# EAGLE design mainPCB (EAGLE 9.2.2)
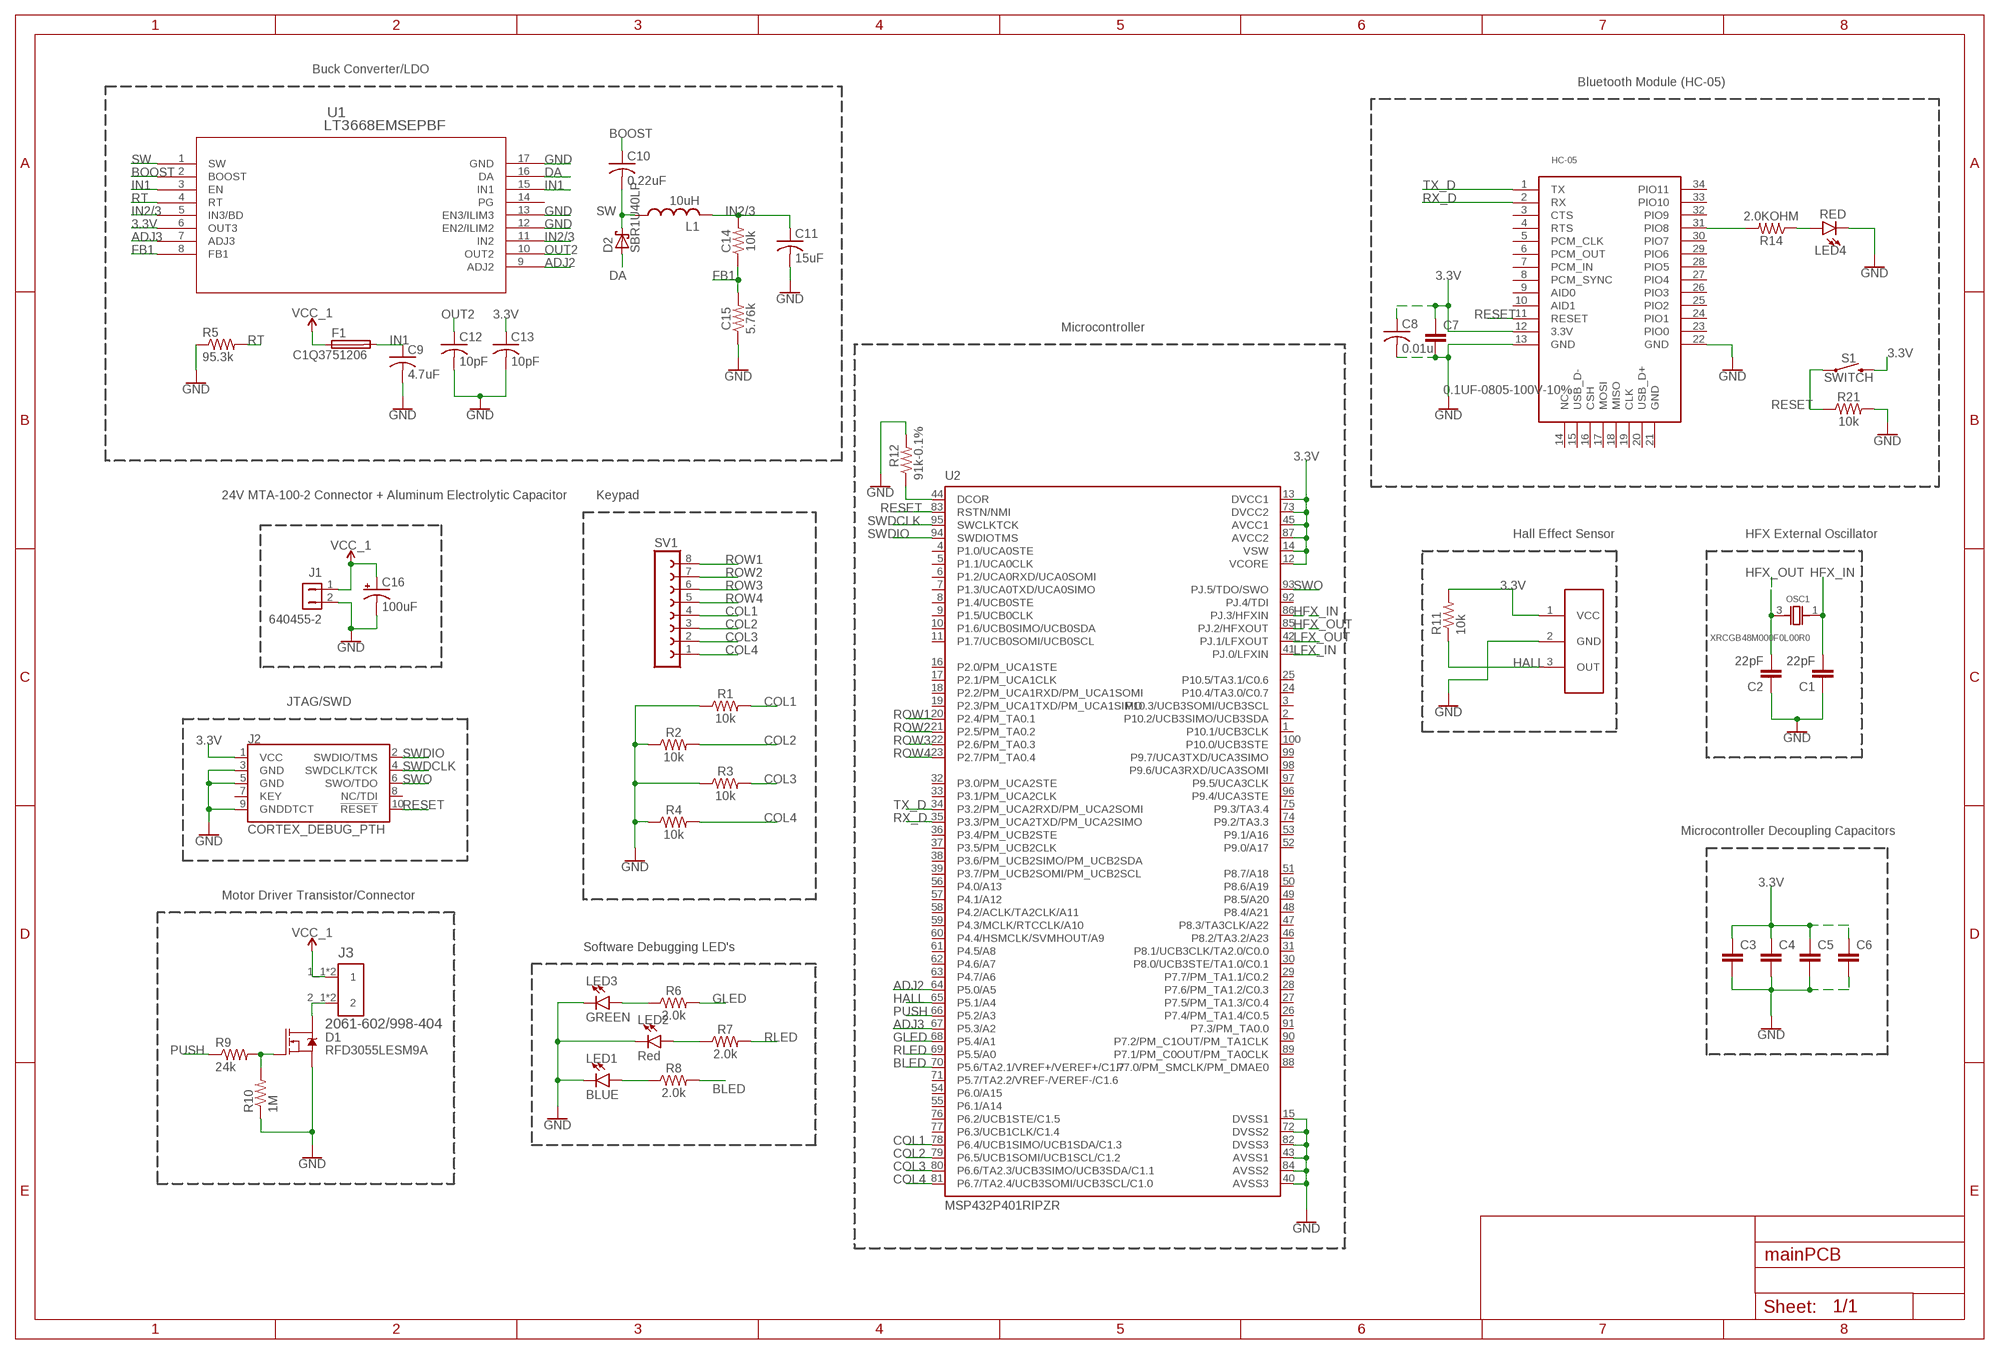
[diagram p0: schematic, sheet 1]

## Parts
C1  22pF  22PF-0603-50V-5%  [0603]
C2  22pF  22PF-0603-50V-5%  [0603]
C3  0.1UF-0805-100V-10%  [0805]
C4  0.1UF-0805-100V-10%  [0805]
C5  0.1UF-0805-100V-10%  [0805]
C6  0.1UF-0805-100V-10%  [0805]
C7  0.1UF-0805-100V-10%  [0805]
C8  0.01u  C-USC0805  [C0805]
C9  4.7uF  C-USC0805  [C0805]
C10  0.22uF  C-USC0805  [C0805]
C11  15uF  C-USC0805  [C0805]
C12  10pF  C-USC0805  [C0805]
C13  10pF  C-USC0805  [C0805]
C14  10k  ERJ-PB6  [R0805]
C15  5.76k  ERJ-PB6  [R0805]
C16  100uF  EEE-1HA101UP  [PANASONIC_D]
D1  RFD3055LESM9A  [DPAK229P990X239-4N]
D2  SBR1U40LP  [3-XDFN]
F1  C1Q3751206  [C1206]
H1  HES  AH1807-P-B  [SIP3-UA]
HC-05  HC-05  HC-05HC-05  [XCVR_HC-05]
J1  640455-2  [2-PIN_CONNECTOR]
J2  CORTEX_DEBUG_PTH  [2X5-PTH-1.27MM]
J3  2061-602/998-404  [WAGO_2061-602/998-404]
L1  10uH  CBC3225T150KR1210  [L3225M]
LED1  BLUE  LED-BLUE0603  [LED-0603]
LED2  Red  LED-RED0603-SMART  [LED-0603]
LED3  GREEN  LED-GREEN0603  [LED-0603]
LED4  RED  LED-RED0603  [LED-0603]
OSC1  XRCGB48M000F0L00R0  [XTAL_XRCGB24M000F0L00R0]
R1  10k  10KOHM-0805-1/4W-1%  [0805]
R2  10k  10KOHM-0805-1/4W-1%  [0805]
R3  10k  10KOHM-0805-1/4W-1%  [0805]
R4  10k  10KOHM-0805-1/4W-1%  [0805]
R5  95.3k  R-US_R0805  [R0805]
R6  2.0k  2.0KOHM-0603-1/10W-5%  [0603]
R7  2.0k  2.0KOHM-0603-1/10W-5%  [0603]
R8  2.0k  2.0KOHM-0603-1/10W-5%  [0603]
R9  24k  R-US_R0805  [R0805]
R10  1M  R-US_R0805  [R0805]
R11  10k  R-US_R0805  [R0805]
R12  91k-0.1%  R-US_R0805  [R0805]
R14  2.0KOHM  [0805]
R21  10k  10KOHM-0805-1/4W-1%  [0805]
S1  SWITCH  MOMENTARY-SWITCH-SPST-SMD-5.2-REDUNDANT  [TACTILE_SWITCH_SMD_5.2MM]
SV1  FE08-1  [FE08]
U1  LT3668EMSEPBF  [MSOP-16_MSE]
U2  MSP432P401RIPZR  [QFP50P1600X1600X160-100N]

## Nets
3.3V: C3.1 C4.1 C5.1 C6.1 C7.1 C8.1 C13.1 H1.1(VCC) HC-05.12(3.3V) J2.1(VCC) R11.2 S1.3 S1.4 U1.6(OUT3) U2.12(VCORE) U2.13(DVCC1) U2.14(VSW) U2.45(AVCC1) U2.73(DVCC2) U2.87(AVCC2)
ADJ2: U1.9(ADJ2) U2.64(P5.0/A5)
ADJ3: U1.7(ADJ3) U2.67(P5.3/A2)
BLED: R8.2 U2.70(P5.6/TA2.1/VREF+/VEREF+/C1.7)
BOOST: C10.1 U1.2(BOOST)
COL1: R1.2 SV1.4 U2.78(P6.4/UCB1SIMO/UCB1SDA/C1.3)
COL2: R2.2 SV1.3 U2.79(P6.5/UCB1SOMI/UCB1SCL/C1.2)
COL3: R3.2 SV1.2 U2.80(P6.6/TA2.3/UCB3SIMO/UCB3SDA/C1.1)
COL4: R4.2 SV1.1 U2.81(P6.7/TA2.4/UCB3SOMI/UCB3SCL/C1.0)
DA: D2.1(A) U1.16(DA)
FB1: C14.1 C15.2 U1.8(FB1)
GLED: R6.2 U2.68(P5.4/A1)
GND: C1.1 C2.1 C3.2 C4.2 C5.2 C6.2 C7.2 C8.2 C9.2 C11.2 C12.2 C13.2 C15.1 C16.- D1.3(S) H1.2(GND) HC-05.13(GND) HC-05.22(GND) J1.2 J2.3(GND) J2.5(GND) J2.9(GNDDTCT) LED1.C LED2.C LED3.C LED4.C R1.1 R2.1 R3.1 R4.1 R5.1 R10.1 R12.2 R21.2 U1.12(EN2/ILIM2) U1.13(EN3/ILIM3) U1.17(GND) U2.15(DVSS1) U2.40(AVSS3) U2.43(AVSS1) U2.72(DVSS2) U2.82(DVSS3) U2.84(AVSS2)
HALL: H1.3(OUT) R11.1 U2.65(P5.1/A4)
HFX_IN: C1.2 OSC1.1 U2.86(PJ.3/HFXIN)
HFX_OUT: C2.2 OSC1.3 U2.85(PJ.2/HFXOUT)
IN1: C9.1 F1.2 U1.3(EN) U1.15(IN1)
IN2/3: C11.1 C14.2 L1.2 U1.5(IN3/BD) U1.11(IN2)
LFX_IN: U2.41(PJ.0/LFXIN)
LFX_OUT: U2.42(PJ.1/LFXOUT)
N$1: D1.1(G) R9.2 R10.2
N$2: D1.4(D) J3.2_1 J3.2_2
N$3: LED4.A R14.1
N$4: LED3.A R6.1
N$5: LED2.A R7.1
N$8: LED1.A R8.1
N$12: R12.1 U2.44(DCOR)
N$19: HC-05.31(PIO8) R14.2
OUT2: C12.1 U1.10(OUT2)
PUSH: R9.1 U2.66(P5.2/A3)
RESET: HC-05.11(RESET) J2.10(!RESET) R21.1 S1.1 S1.2 U2.83(RSTN/NMI)
RLED: R7.2 U2.69(P5.5/A0)
ROW1: SV1.8 U2.20(P2.4/PM_TA0.1)
ROW2: SV1.7 U2.21(P2.5/PM_TA0.2)
ROW3: SV1.6 U2.22(P2.6/PM_TA0.3)
ROW4: SV1.5 U2.23(P2.7/PM_TA0.4)
RT: R5.2 U1.4(RT)
RX_D: HC-05.2(RX) U2.35(P3.3/PM_UCA2TXD/PM_UCA2SIMO)
SW: C10.2 D2.2(C) D2.3(C) L1.1 U1.1(SW)
SWDCLK: J2.4(SWDCLK/TCK) U2.95(SWCLKTCK)
SWDIO: J2.2(SWDIO/TMS) U2.94(SWDIOTMS)
SWO: J2.6(SWO/TDO) U2.93(PJ.5/TDO/SWO)
TX_D: HC-05.1(TX) U2.34(P3.2/PM_UCA2RXD/PM_UCA2SOMI)
VCC_1: C16.+ F1.1 J1.1 J3.1_1 J3.1_2
Unconnected: HC-05.3(CTS) HC-05.4(RTS) HC-05.5(PCM_CLK) HC-05.6(PCM_OUT) HC-05.7(PCM_IN) HC-05.8(PCM_SYNC) HC-05.9(AID0) HC-05.10(AID1) HC-05.14(NC) HC-05.15(USB_D-) HC-05.16(CSH) HC-05.17(MOSI) HC-05.18(MISO) HC-05.19(CLK) HC-05.20(USB_D+) HC-05.21(GND) HC-05.23(PIO0) HC-05.24(PIO1) HC-05.25(PIO2) HC-05.26(PIO3) HC-05.27(PIO4) HC-05.28(PIO5) HC-05.29(PIO6) HC-05.30(PIO7) HC-05.32(PIO9) HC-05.33(PIO10) HC-05.34(PIO11) J2.7(KEY) J2.8(NC/TDI) U1.14(PG) U2.1(P10.1/UCB3CLK) U2.2(P10.2/UCB3SIMO/UCB3SDA) U2.3(P10.3/UCB3SOMI/UCB3SCL) U2.4(P1.0/UCA0STE) U2.5(P1.1/UCA0CLK) U2.6(P1.2/UCA0RXD/UCA0SOMI) U2.7(P1.3/UCA0TXD/UCA0SIMO) U2.8(P1.4/UCB0STE) U2.9(P1.5/UCB0CLK) U2.10(P1.6/UCB0SIMO/UCB0SDA) U2.11(P1.7/UCB0SOMI/UCB0SCL) U2.16(P2.0/PM_UCA1STE) U2.17(P2.1/PM_UCA1CLK) U2.18(P2.2/PM_UCA1RXD/PM_UCA1SOMI) U2.19(P2.3/PM_UCA1TXD/PM_UCA1SIMO) U2.24(P10.4/TA3.0/C0.7) U2.25(P10.5/TA3.1/C0.6) U2.26(P7.4/PM_TA1.4/C0.5) U2.27(P7.5/PM_TA1.3/C0.4) U2.28(P7.6/PM_TA1.2/C0.3) U2.29(P7.7/PM_TA1.1/C0.2) U2.30(P8.0/UCB3STE/TA1.0/C0.1) U2.31(P8.1/UCB3CLK/TA2.0/C0.0) U2.32(P3.0/PM_UCA2STE) U2.33(P3.1/PM_UCA2CLK) U2.36(P3.4/PM_UCB2STE) U2.37(P3.5/PM_UCB2CLK) U2.38(P3.6/PM_UCB2SIMO/PM_UCB2SDA) U2.39(P3.7/PM_UCB2SOMI/PM_UCB2SCL) U2.46(P8.2/TA3.2/A23) U2.47(P8.3/TA3CLK/A22) U2.48(P8.4/A21) U2.49(P8.5/A20) U2.50(P8.6/A19) U2.51(P8.7/A18) U2.52(P9.0/A17) U2.53(P9.1/A16) U2.54(P6.0/A15) U2.55(P6.1/A14) U2.56(P4.0/A13) U2.57(P4.1/A12) U2.58(P4.2/ACLK/TA2CLK/A11) U2.59(P4.3/MCLK/RTCCLK/A10) U2.60(P4.4/HSMCLK/SVMHOUT/A9) U2.61(P4.5/A8) U2.62(P4.6/A7) U2.63(P4.7/A6) U2.71(P5.7/TA2.2/VREF-/VEREF-/C1.6) U2.74(P9.2/TA3.3) U2.75(P9.3/TA3.4) U2.76(P6.2/UCB1STE/C1.5) U2.77(P6.3/UCB1CLK/C1.4) U2.88(P7.0/PM_SMCLK/PM_DMAE0) U2.89(P7.1/PM_C0OUT/PM_TA0CLK) U2.90(P7.2/PM_C1OUT/PM_TA1CLK) U2.91(P7.3/PM_TA0.0) U2.92(PJ.4/TDI) U2.96(P9.4/UCA3STE) U2.97(P9.5/UCA3CLK) U2.98(P9.6/UCA3RXD/UCA3SOMI) U2.99(P9.7/UCA3TXD/UCA3SIMO) U2.100(P10.0/UCB3STE)

## Notes on the sheet
- Buck Converter/LDO
- Bluetooth Module (HC-05)
- Microcontroller
- 24V MTA-100-2 Connector + Aluminum Electrolytic Capacitor | Keypad
- Hall Effect Sensor | HFX External Oscillator
- JTAG/SWD
- Microcontroller Decoupling Capacitors
- Motor Driver Transistor/Connector
- Software Debugging LED's

## Library data of the parts
C1 C2 = SparkFun-Capacitors:22PF: 22pF ceramic capacitors A capacitor is a passive two-terminal electrical component used to store electrical energy temporarily in an electric field.; PROD_ID: CAP-07876
C3-C7 = SENIOR_DESIGN_COMPONENTS:0.1UF: 0.1µF ceramic capacitors A capacitor is a passive two-terminal electrical component used to store electrical energy temporarily in an electric field.
C8-C13 = SENIOR_DESIGN_COMPONENTS:C-US: CAPACITOR, American symbol; SPICEPREFIX: C
C14 C15 = SENIOR_DESIGN_COMPONENTS:ERJ-PB6
C16 = SENIOR_DESIGN_COMPONENTS:EEE-1HA101UP
D1 = SENIOR_DESIGN_COMPONENTS:RFD3055LESM9A
D2 = SENIOR_DESIGN_COMPONENTS:SBR1U40LP
F1 = SENIOR_DESIGN_COMPONENTS:C1Q375
H1 = SENIOR_DESIGN_COMPONENTS:AH1807-P-B
HC-05 = SENIOR_DESIGN_COMPONENTS:HC-05
J1 = SENIOR_DESIGN_COMPONENTS:640455-2: 2 Pin Rectangular Connector; AVAILABILITY: Unavailable; COMMENT: 640455-2; DESCRIPTION: MTA-100 2 Position 2.54 mm Single Row Right Angle Wire to Board Header; EU_ROHS_COMPLIANCE: Compliant; MF: TE Connectivity; MP: 640455-2; PACKAGE: None; PRICE: None; TE_PURCHASE_URL: https://www.te.com/usa-en/product-640455-2.html?te_bu=Cor&te_type=disp&te_campaign=seda_glo_cor-seda-global-disp-prtnr-fy19-seda-model-bom-cta_sma-317_1&elqCampaignId=32493
J2 = SparkFun-Connectors:CORTEX_DEBUG: Cortex Debug Connector - 10 pin Supports JTAG debug, Serial Wire debug, and Serial Wire Viewer. PTH and SMD connector options available. General Connector Information <http://infocenter.arm.com/help/topic/com.arm.doc.faqs/attached/13634/cortex_debug_connectors.pdf> Products: PTH Connector <http://www.digikey.com/product-detail/en/cnc-tech/3220-10-0100-00/1175-1627-ND/3883661> -via Digi-Key SparkFun PSoc <https://www.sparkfun.com/products/13229> SparkFun T <https://www.sparkfun.com/products/13810>
J3 = SENIOR_DESIGN_COMPONENTS:2061-602/998-404: 2061 Series 2 Position 20-16 AWG 6 mm Spacing Surface Mount Terminal Block; AVAILABILITY: Unavailable; DESCRIPTION: 2061 Series 2 Position 20-16 AWG 6 mm Spacing Surface Mount Terminal Block; MF: WAGO; MP: 2061-602/998-404; PACKAGE: None; PRICE: None
L1 = SENIOR_DESIGN_COMPONENTS:CBC3225T150KR
LED1 = SENIOR_DESIGN_COMPONENTS:LED-BLUE: Blue SMD LED Used in manufacturing of various products at SparkFun Packages: 0603 - SMD 0603 package [Product Link] <http://www.digikey.com/product-detail/en/SMLE12BC7TT86/511-1589-2-ND/1641808> 1206 - SMD1206 package [Product Link] <http://www.digikey.com/product-detail/en/lite-on-inc/LTST-C150TBKT/160-1643-1-ND/573584> SparkFun Products: ESP8266 Thing-Dev Board <https://www.sparkfun.com/products/13711> RedBoard <https://www.sparkfun.com/products/12757>; PROD_ID: DIO-08575
LED2 = SENIOR_DESIGN_COMPONENTS:LED-RED: Red SMD LED Used in manufacturing of most products at SparkFun Packages: 0603 - SMD 0603 package [Product Link] <http://docs.avagotech.com/docs/AV02-0551EN> 0603 SMART - SMD 0603 SMART package ( more efficient and expensive)[Product Link] <http://www.osram-os.com/Graphics/XPic2/00077099_0.pdf> 1206 - SMD1206 package [Product Link] <https://www.sparkfun.com/datasheets/DevTools/LilyPad/Q150OVS4.pdff> SparkFun Products: Pro Mini 328 -5V <https://www.sparkfun.com/products/821> RedBoard <https://www.sparkfun.com/products/12757> IOIO-OTG <https://www.sparkfun.com/products/13613>; PROD_ID: DIO-11154
LED3 = SENIOR_DESIGN_COMPONENTS:LED-GREEN: Green SMD LED Used in manufacturing of various products at SparkFun Packages: 0603 - SMD 0603 package [Product Link] <http://www.futureelectronics.com/en/technologies/semiconductors/optoelectronics/leds/Pages/9894312-LTST-C190GKT.aspx?CrossPart=HSMG-C190&IM=0> LilyPad 1206 - SMD1206 LilyPad package [Product Link] <http://www.futureelectronics.com/en/Technologies/Product.aspx?ProductID=IN150NGHARVATEKCORPORATION2049943&IM=0> 1206 - SMD1206 package [Product Link] <http://www.futureelectronics.com/en/technologies/semiconductors/optoelectronics/leds/Pages/8315665-LTST-C150KGKT.aspx?IM=0> 1206 Bottom Mount -SMD 1206 Bottom Mount [Product Link] <http://www.digikey.com/product-detail/en/lite-on-inc/LTST-C230KGKT/160-1456-1-ND/386854> SparkFun Products: Pro Mini 328 -5V <https://www.sparkfun.com/products/821> RedBoard <https://www.sparkfun.com/products/12757> MP3 Trigger <https://www.sparkfun.com/products/13720> Makey Makey <https://www.sparkfun.com/products/11076>; PROD_ID: DIO-00821
LED4 = SENIOR_DESIGN_COMPONENTS:LED-RED: Red SMD LED Used in manufacturing of most products at SparkFun Packages: 0603 - SMD 0603 package [Product Link] <http://docs.avagotech.com/docs/AV02-0551EN> 0603 SMART - SMD 0603 SMART package ( more efficient and expensive)[Product Link] <http://www.osram-os.com/Graphics/XPic2/00077099_0.pdf> 1206 - SMD1206 package [Product Link] <https://www.sparkfun.com/datasheets/DevTools/LilyPad/Q150OVS4.pdff> SparkFun Products: Pro Mini 328 -5V <https://www.sparkfun.com/products/821> RedBoard <https://www.sparkfun.com/products/12757> IOIO-OTG <https://www.sparkfun.com/products/13613>; PROD_ID: DIO-00819
OSC1 = SENIOR_DESIGN_COMPONENTS:XRCGB48M000F0L00R0
R1-R4 R21 = SENIOR_DESIGN_COMPONENTS:10KOHM: 10kΩ resistor A resistor is a passive two-terminal electrical component that implements electrical resistance as a circuit element. Resistors act to reduce current flow, and, at the same time, act to lower voltage levels within circuits. - Wikipedia
R5 R9-R12 = SENIOR_DESIGN_COMPONENTS:R-US_: RESISTOR, American symbol; SPICEPREFIX: R
R6-R8 = SENIOR_DESIGN_COMPONENTS:2.0KOHM: 2kΩ resistor A resistor is a passive two-terminal electrical component that implements electrical resistance as a circuit element. Resistors act to reduce current flow, and, at the same time, act to lower voltage levels within circuits. - Wikipedia; PROD_ID: RES-08296
R14 = SENIOR_DESIGN_COMPONENTS:2.0KOHM: 2kΩ resistor A resistor is a passive two-terminal electrical component that implements electrical resistance as a circuit element. Resistors act to reduce current flow, and, at the same time, act to lower voltage levels within circuits. - Wikipedia
S1 = SENIOR_DESIGN_COMPONENTS:MOMENTARY-SWITCH-SPST: Momentary Switch (Pushbutton) - SPST Normally-open (NO) SPST momentary switches (buttons, pushbuttons). Variants PTH-12MM - 12mm square, through-hole Momentary Pushbutton Switch - 12mm Square <https://www.sparkfun.com/products/9190> (COM-09190) PTH-6.0MM, PTH-6.0MM-KIT - 6.0mm square, through-hole Mini Pushbutton Switch <https://www.sparkfun.com/products/97> (COM-00097) KIT package intended for soldering kit's - only one side of pads' copper is exposed. PTH-RIGHT-ANGLE-KIT - Right-angle, through-hole Right Angle Tactile Button <https://www.sparkfun.com/products/10791> - Used on SparkFun BigTime Watch Kit <https://www.sparkfun.com/products/11734> SMD-12MM - 12mm square, surface-mount Tactile Button - SMD (12mm) <https://www.sparkfun.com/products/12993> (COM-12993) Used on SparkFun PicoBoard <https://www.sparkfun.com/products/11888> SMD-4.5MM - 4.5mm Square Trackball Switch Used on SparkFun Blackberry Trackballer Breakout <https://www.sparkfun.com/products/13169> SMD-4.6MMX2.8MM - 4.60mm x 2.80mm, surface mount Used on SparkFun SAMD21 Mini Breakout <https://www.sparkfun.com/products/13664> SMD-5.2MM, SMD-5.2-REDUNDANT - 5.2mm square, surface-mount Mini Pushbutton Switch - SMD <https://www.sparkfun.com/products/8720> (COM-08720) Used on Arduino Pro Mini <https://www.sparkfun.com/products/11114> REDUNDANT package connects both switch circuits together SMD-6.0X3.5MM - 6.0 x 3.5mm, surface mount Momentary Reset Switch SMD <https://www.sparkfun.com/products/8229> (COM-08229) SMD-6.2MM-TALL - 6.2mm square, surface mount Tactile Button - SMD (6mm) <https://www.sparkfun.com/products/12992> Used on SparkFun Digital Sandbox <https://www.sparkfun.com/products/12651> SMD-RIGHT-ANGLE - Right-angle, surface mount Used on SparkFun Block for Intel® Edison - Arduino <https://www.sparkfun.com/products/13036>; PROD_ID: SWCH-08247; SF_SKU: COM-08720
SV1 = SENIOR_DESIGN_COMPONENTS:FE08-1: FEMALE HEADER; OC_FARNELL: unknown; OC_NEWARK: unknown
U1 = SENIOR_DESIGN_COMPONENTS:LT3668EMSEPBF; DESCRIPTION: LT3668 - 40V 400mA Step-Down Switching Regulator with Dual Fault Protected Tracking LDOs; DIGI-KEY_PART_NUMBER: LT3668EMSE#PBF-ND; DIGI-KEY_PURCHASE_URL: https://www.digikey.com/product-detail/en/linear-technology-analog-devices/LT3668EMSE-PBF/LT3668EMSE-PBF-ND/5030729?utm_source=snapeda&utm_medium=aggregator&utm_campaign=symbol; MF: Linear Technology; MP: LT3668EMSE#PBF; PACKAGE: MSOP-16 Linear Technology
U2 = SENIOR_DESIGN_COMPONENTS:MSP432P401RIPZR: Low-Power and High Performance 32-Bit ARM Cortex M4F With 256KB Flash and 64KB RAM 100-LQFP -40 to 85; AVAILABILITY: Unavailable; DESCRIPTION: Low-Power and High Performance 32-Bit ARM Cortex M4F With 256KB Flash and 64KB RAM 100-LQFP -40 to 85; MF: Texas Instruments; MP: MSP432P401RIPZR; PACKAGE: LQFP-100 Texas Instruments; PRICE: None

## Board
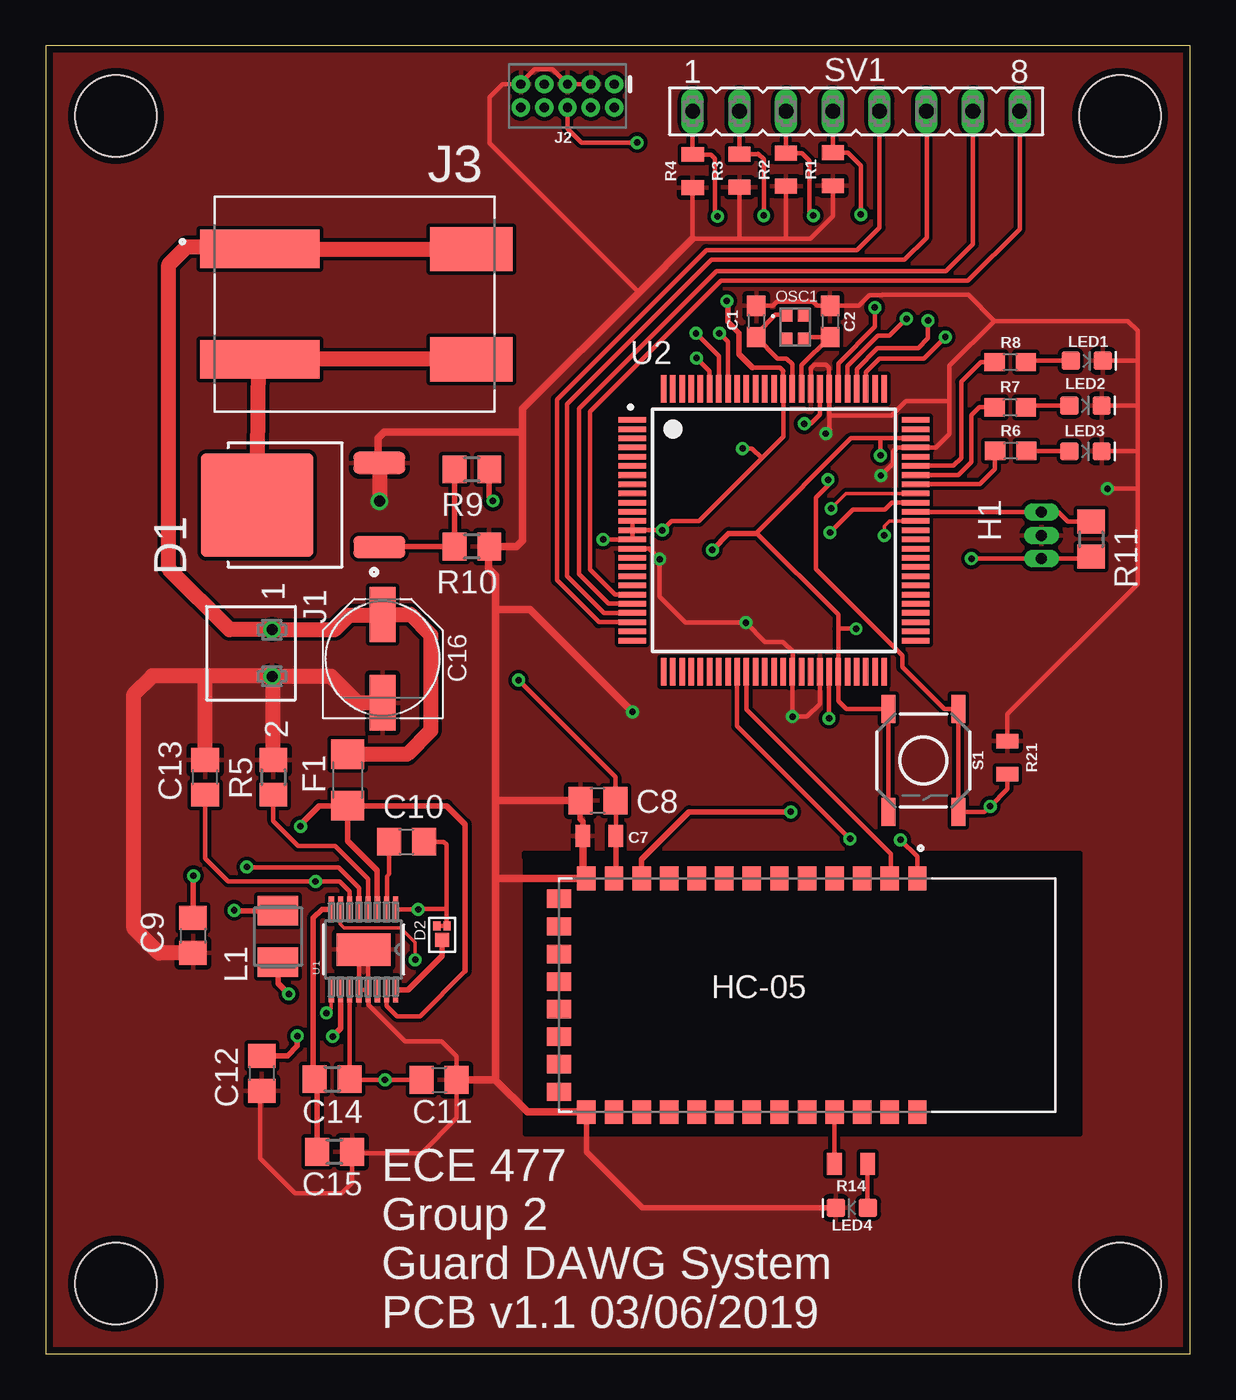
[diagram p1: board, top side]
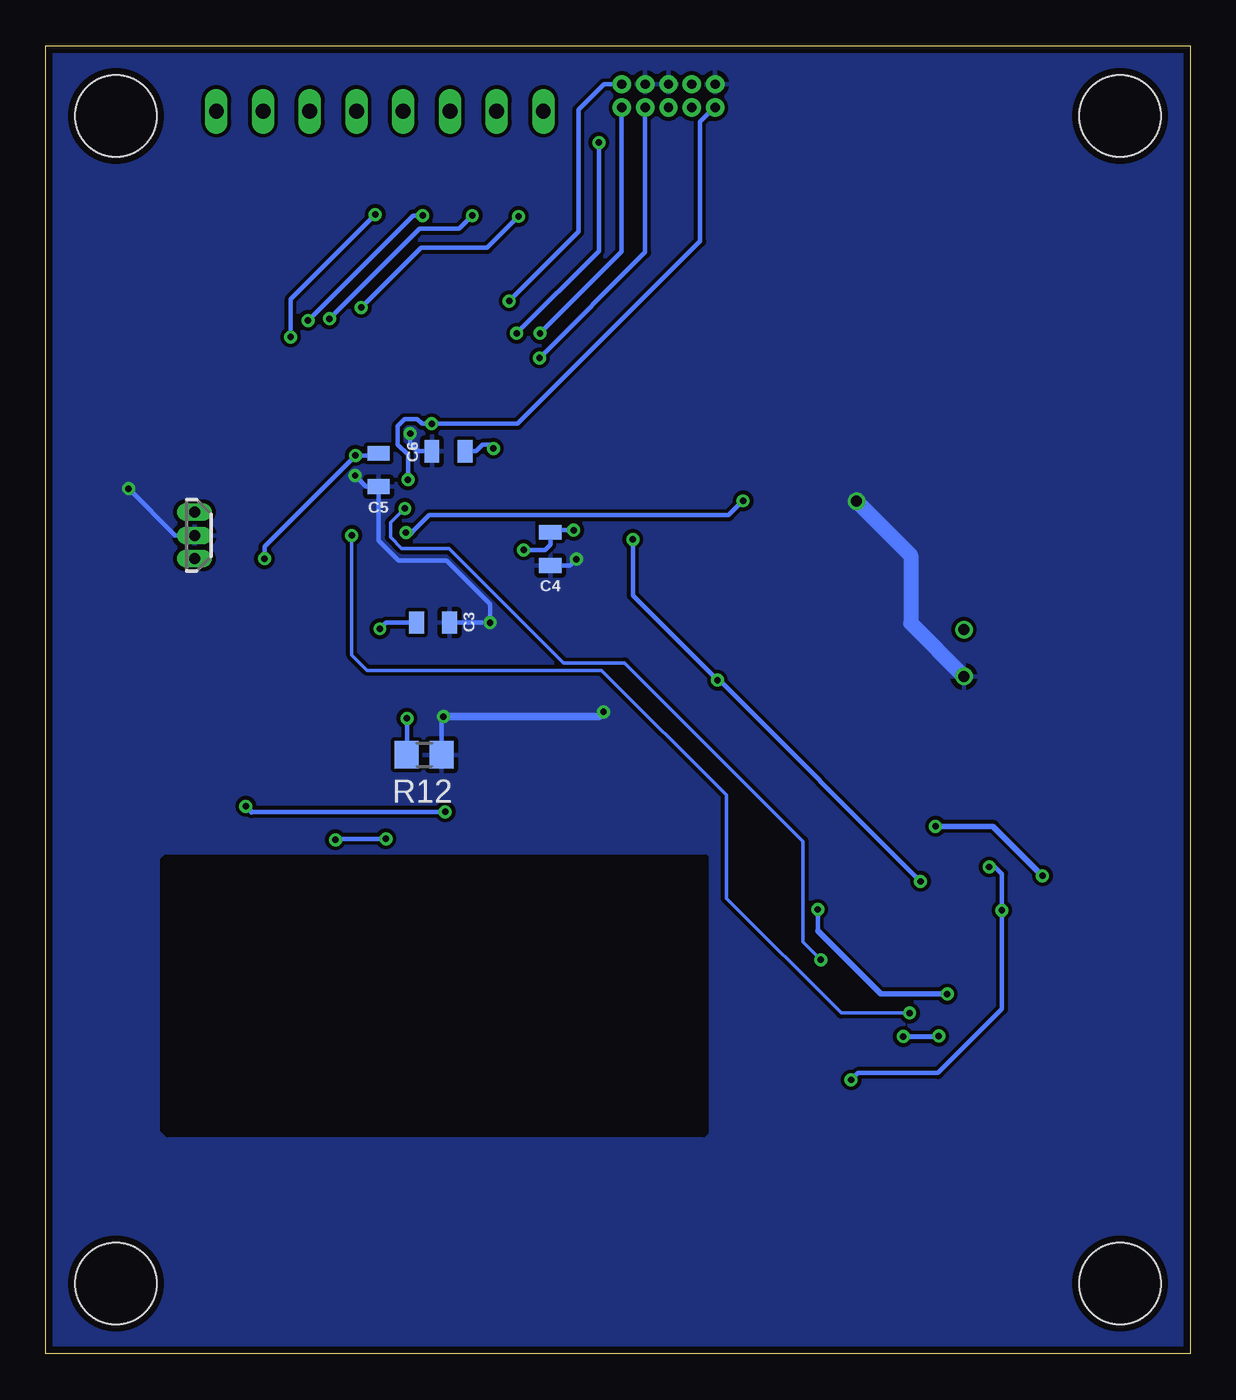
[diagram p2: board, bottom side, seen from below]

Size 62.23 x 71.12 mm. Coordinates in mm from the lower left corner, seen from the top.
Outline: 0,0 62.23,0 62.23,71.12 0,71.12 0,0
Copper layers (1*16): Top 0.0356mm / dielectric 1.5011mm / Bottom 0.0356mm
Design rules "ECE_Senior_Design": minimum track width 8mil, minimum drill 13mil, track to track 8mil, track to pad 8mil, pad to pad 6mil, via to via 8mil, smd to smd 6mil, copper to edge 15mil, drill to drill 8mil, minimum pad ring 7mil, minimum via ring 7mil, stop-mask expansion 3mil, vias tented up to drill 0mil, thermal gap 10mil
Holes 4.45 mm at 3.81,67.31 58.42,67.31 58.42,3.81 3.81,3.81

### Footprints (pad centres in the part's own frame; a part is rotated, then mirrored left to right if it is on the bottom)
0603 = smd 1.1 x 1: 1 -0.85,0; 2 0.85,0
0805 = smd 0.8 x 1.2: 1 -0.9,0; 2 0.9,0
C0805 = smd 1.3 x 1.5: 1 -0.95,0; 2 0.95,0
R0805 = smd 1.3 x 1.5: 1 -0.95,0; 2 0.95,0
PANASONIC_D = smd 3 x 1.4: + 2.4,0; - -2.4,0
DPAK229P990X239-4N = smd 1.22 x 2.83: 1 -2.29,-4.14; 3 2.29,-4.14 | smd 5.63 x 6.1: 4 0,2.51
3-XDFN = smd 0.75 x 0.75: 1 0,0 | smd 0.48 x 0.4: 2 0.76,0.275; 3 0.76,-0.275
C1206 = smd 1.6 x 1.8: 1 -1.4,0; 2 1.4,0
SIP3-UA = drill 0.6 pad 0.7 long: 1 -1.27,0; 2 0,0; 3 1.27,0
XCVR_HC-05 = smd 1.3 x 1: 1 -6.35,6.325; 2 -6.35,4.825; 3 -6.35,3.325; 4 -6.35,1.825; 5 -6.35,0.325; 6 -6.35,-1.175; 7 -6.35,-2.675; 8 -6.35,-4.175; 9 -6.35,-5.675; 10 -6.35,-7.175; 11 -6.35,-8.675; 12 -6.35,-10.175; 13 -6.35,-11.675; 22 6.35,-11.675; 23 6.35,-10.175; 24 6.35,-8.675; 25 6.35,-7.175; 26 6.35,-5.675; 27 6.35,-4.175; 28 6.35,-2.675; 29 6.35,-1.175; 30 6.35,0.325; 31 6.35,1.825; 32 6.35,3.325; 33 6.35,4.825; 34 6.35,6.325 | smd 1 x 1.3: 14 -5.25,-13.175; 15 -3.75,-13.175; 16 -2.25,-13.175; 17 -0.75,-13.175; 18 0.75,-13.175; 19 2.25,-13.175; 20 3.75,-13.175; 21 5.25,-13.175
2-PIN_CONNECTOR = drill 0.6: 1 -1.27,0; 2 1.27,0
2X5-PTH-1.27MM = drill 0.508 pad 1: 1 -2.54,-0.635; 2 -2.54,0.635; 3 -1.27,-0.635; 4 -1.27,0.635; 5 0,-0.635; 6 0,0.635; 7 1.27,-0.635; 8 1.27,0.635; 9 2.54,-0.635; 10 2.54,0.635
WAGO_2061-602/998-404 = smd 6.5 x 2.1: 1_1 -5.15,3; 2_1 -5.15,-3 | smd 4.5 x 2.4: 1_2 6.35,3; 2_2 6.35,-3
L3225M = smd 1.6 x 2.2: 1 -1.4,0; 2 1.4,0
LED-0603 = smd 1 x 1: A -0.877,0; C 0.877,0
XTAL_XRCGB24M000F0L00R0 = smd 0.7 x 0.75: 1 -0.5,0.675; 2 -0.5,-0.675; 3 0.5,-0.675; 4 0.5,0.675
TACTILE_SWITCH_SMD_5.2MM = smd 1.524 x 0.762: 1 -2.794,1.905; 2 2.794,1.905; 3 -2.794,-1.905; 4 2.794,-1.905
FE08 = drill 0.813 long: 1 -8.89,0; 2 -6.35,0; 3 -3.81,0; 4 -1.27,0; 5 1.27,0; 6 3.81,0; 7 6.35,0; 8 8.89,0
MSOP-16_MSE = smd 1.397 x 0.279: 1 -2.184,1.751; 2 -2.184,1.251; 3 -2.184,0.751; 4 -2.184,0.25; 5 -2.184,-0.25; 6 -2.184,-0.751; 7 -2.184,-1.251; 8 -2.184,-1.751; 9 2.184,-1.751; 10 2.184,-1.251; 11 2.184,-0.751; 12 2.184,-0.25; 13 2.184,0.25; 14 2.184,0.751; 15 2.184,1.251; 16 2.184,1.751 | smd 1.753 x 2.946: 17 0,0
QFP50P1600X1600X160-100N = smd 1.5 x 0.3: 1 -7.7,6; 2 -7.7,5.5; 3 -7.7,5; 4 -7.7,4.5; 5 -7.7,4; 6 -7.7,3.5; 7 -7.7,3; 8 -7.7,2.5; 9 -7.7,2; 10 -7.7,1.5; 11 -7.7,1; 12 -7.7,0.5; 13 -7.7,0; 14 -7.7,-0.5; 15 -7.7,-1; 16 -7.7,-1.5; 17 -7.7,-2; 18 -7.7,-2.5; 19 -7.7,-3; 20 -7.7,-3.5; 21 -7.7,-4; 22 -7.7,-4.5; 23 -7.7,-5; 24 -7.7,-5.5; 25 -7.7,-6; 51 7.7,-6; 52 7.7,-5.5; 53 7.7,-5; 54 7.7,-4.5; 55 7.7,-4; 56 7.7,-3.5; 57 7.7,-3; 58 7.7,-2.5; 59 7.7,-2; 60 7.7,-1.5; 61 7.7,-1; 62 7.7,-0.5; 63 7.7,0; 64 7.7,0.5; 65 7.7,1; 66 7.7,1.5; 67 7.7,2; 68 7.7,2.5; 69 7.7,3; 70 7.7,3.5; 71 7.7,4; 72 7.7,4.5; 73 7.7,5; 74 7.7,5.5; 75 7.7,6 | smd 0.3 x 1.5: 26 -6,-7.7; 27 -5.5,-7.7; 28 -5,-7.7; 29 -4.5,-7.7; 30 -4,-7.7; 31 -3.5,-7.7; 32 -3,-7.7; 33 -2.5,-7.7; 34 -2,-7.7; 35 -1.5,-7.7; 36 -1,-7.7; 37 -0.5,-7.7; 38 0,-7.7; 39 0.5,-7.7; 40 1,-7.7; 41 1.5,-7.7; 42 2,-7.7; 43 2.5,-7.7; 44 3,-7.7; 45 3.5,-7.7; 46 4,-7.7; 47 4.5,-7.7; 48 5,-7.7; 49 5.5,-7.7; 50 6,-7.7; 76 6,7.7; 77 5.5,7.7; 78 5,7.7; 79 4.5,7.7; 80 4,7.7; 81 3.5,7.7; 82 3,7.7; 83 2.5,7.7; 84 2,7.7; 85 1.5,7.7; 86 1,7.7; 87 0.5,7.7; 88 0,7.7; 89 -0.5,7.7; 90 -1,7.7; 91 -1.5,7.7; 92 -2,7.7; 93 -2.5,7.7; 94 -3,7.7; 95 -3.5,7.7; 96 -4,7.7; 97 -4.5,7.7; 98 -5,7.7; 99 -5.5,7.7; 100 -6,7.7

### Placement (x,y rotation side)
C1  38.63,56.13 270 top
C2  42.65,56.13 270 top
C3  41.17,39.75 0 bottom
C4  34.8,43.76 270 bottom
C5  44.15,48.06 270 bottom
C6  40.34,49.07 180 bottom
C7  30.1,28.14 180 top
C8  30.02,30.07 180 top
C9  8,22.73 270 top
C10  19.61,27.84 0 top
C11  21.39,14.88 0 top
C12  11.73,15.24 270 top
C13  8.66,31.34 90 top
C14  15.57,14.94 0 top
C15  15.7,10.97 180 top
C16  18.31,37.8 90 top
D1  14,46.15 90 top
D2  21.54,22.5 90 top
F1  16.41,31.19 270 top
H1  54.15,44.5 90 bottom
HC-05  41.07,19.48 270 top
J1  12.29,38.1 270 top
J2  28.37,68.4 180 top
J3  16.79,57.07 0 top
L1  12.62,22.68 90 top
LED1  56.62,54 0 top
LED2  56.54,51.56 0 top
LED3  56.54,49.07 0 top
LED4  43.84,7.92 180 top
OSC1  40.74,55.83 0 top
R1  42.8,64.41 90 top
R2  40.26,64.39 90 top
R3  37.72,64.34 90 top
R4  35.18,64.31 90 top
R5  12.37,31.34 270 top
R6  52.48,49.1 180 top
R7  52.45,51.46 180 top
R8  52.45,53.92 180 top
R9  23.16,48.08 180 top
R10  23.16,43.89 180 top
R11  56.85,44.3 270 top
R12  41.66,32.56 0 bottom
R14  43.79,10.31 180 top
R21  52.3,32.41 90 top
S1  47.73,32.26 270 top
SV1  44.07,67.56 0 top
U1  17.27,21.97 270 top
U2  39.6,44.78 0 top

### Tracks (layer width: path | path; a pad name or v marks a point on that pad's centre or on a via)
3.3V  (via drill 0.35)
  Top 0.203: 31.01,28.13 C7.1
  Top 0.254: 38.61,44.6 43.79,49.78 45.39,49.78 | 38.68,44.6 43.1,40.18 43.1,39.42 | 45.39,49.78 v45.39,48.84 | 43.1,39.42 v44.07,39.42 | S1.4 S1.3 43.54,35.05 43.1,35.48 U2.45 | U2.13 U2.14 v30.31,44.28 | U2.12 U2.13 | 38.94,48.69 35.53,45.28 34.03,45.28 v33.53,44.78 U2.13 | 38.94,48.69 40.11,49.86 U2.87 40.1,53.43 40.11,53.44 39.91,53.63 38.42,53.63 | 38.94,48.69 38.41,49.23 v37.9,49.23 | U1.6 16.52,25.14 15.98,25.68 v14.66,25.68 9.91,25.68 8.66,26.92 C13.1 | v25.7,36.63 30.97,31.36 C8.1 31.01,30.03 31.01,28.13 | v50.34,43.23 H1.1 56.73,43.23 R11.2 | U2.45 | 43.1,39.42 U2.45 | 45.39,49.78 U2.73
  Top 0.305: 38.68,44.6 38.61,44.6 37.13,44.6 v36.25,43.71 | HC-05.12 31.01,25.95 31.01,28.13 | v37.03,57.25 37.08,57.2 37.08,56.14 37.71,55.51 37.71,54.35 38.42,53.63
  Bottom 0.254: v50.34,43.23 50.34,43.89 v45.39,48.84 44.26,48.84 C5.1 | v37.03,57.25 33.27,61.01 33.27,67.64 31.88,69.04 J2.1 | v37.9,49.23 38.1,49.43 38.48,49.43 38.84,49.07 C6.1 | v44.07,39.42 43.74,39.75 C3.1 | v14.66,25.68 25.6,36.63 v25.7,36.63 30.31,41.23 v30.31,44.28 | v33.53,44.78 33.54,44.79 34.67,44.79 C4.1 34.8,43.99 35.08,43.71 v36.25,43.71
ADJ2  (via drill 0.35)
  Top 0.203: U1.9 15.52,18.79 v15.25,18.52 | v45.59,44.5 45.59,45.01 45.86,45.28 U2.64
  Bottom 0.203: v15.25,18.52 18.97,18.52 25.22,24.77 25.22,30.38 32,37.16 44.76,37.16 45.59,38 v45.59,44.5
ADJ3  (via drill 0.35)
  Top 0.203: v20.08,21.41 20.08,22.35 19.28,23.15 16.23,23.15 16.01,23.36 16.01,24.15 U1.7 | U2.67 43.52,46.78 v42.71,45.97
  Bottom 0.203: v42.71,45.97 43.48,45.2 43.48,44.4 42.88,43.79 40.31,43.79 34.09,37.57 30.76,37.57 21.05,27.86 21.05,22.38 v20.08,21.41
BLED
  Top 0.254: R8.2 50.85,53.92 49.78,52.86 49.78,48.72 49.35,48.28 U2.70
BOOST
  Top 0.254: C10.1 18.66,26.08 18.54,25.96 18.54,24.17 U1.2
COL1  (via drill 0.35)
  Top 0.254: U2.78 44.6,53.39 45.34,54.13 47.75,54.13 v48.92,55.3 | v44.32,61.95 44.32,64.62 43.63,65.31 R1.2 SV1.4
  Bottom 0.254: v48.92,55.3 48.92,57.35 v44.32,61.95
COL2  (via drill 0.35)
  Top 0.254: U2.79 44.1,53.55 45.24,54.69 47.45,54.69 47.98,55.22 v47.98,56.19 | v41.73,61.9 41.53,62.1 41.53,64.87 41.11,65.29 R2.2 SV1.3
  Bottom 0.254: v47.98,56.19 42.27,61.9 v41.73,61.9
COL3  (via drill 0.35)
  Top 0.254: U2.80 43.6,53.71 45.25,55.36 45.89,55.36 v46.81,56.29 | v39.04,61.9 39.04,64.95 38.73,65.25 38.72,65.24 R3.2 SV1.2
  Bottom 0.254: v46.81,56.29 41.91,61.19 39.75,61.19 v39.04,61.9
COL4  (via drill 0.35)
  Top 0.254: v45.09,56.9 45.09,55.84 43.09,53.85 U2.81 | v36.52,61.85 36.4,61.98 36.4,65 36.18,65.21 R4.2 SV1.1
  Bottom 0.254: v45.09,56.9 41.83,60.15 38.23,60.15 v36.52,61.85
DA
  Top 0.305: D2.1 21.54,21.61 19.71,19.79 U1.16
FB1
  Top 0.305: U1.8 15.01,24.16 14.54,23.69 14.54,15.01 C14.1 14.75,14.81 C15.2
GLED
  Top 0.254: R6.2 51.63,48.12 50.81,47.3 47.31,47.3 U2.68
GND  (via drill 0.35, 0.6 pad 0.65)
  Top 0.203: C7.2 | 29.06,30.06 C8.2
  Top 0.254: U2.82 42.6,52.4 | 42.6,52.4 42.62,51.26 42.62,51 | v45.41,47.75 46.08,48.41 46.08,49.05 46.31,49.28 U2.72 48.42,49.28 49.15,50.01 49.15,51.82 | U2.15 32.8,43.78 v33.38,43.2 33.38,41.17 34.8,39.75 v38.08,39.75 39.12,38.71 40.08,38.71 40.62,38.17 40.62,37.06 U2.40 40.6,34.66 v40.62,34.65 41.4,34.65 42.1,35.34 U2.43 | 42.62,51 42.62,50.24 | 17.09,21.97 17.09,21.67 17.02,21.6 U1.12 U1.13 | U1.13 17.52,21.53 17.38,21.67 17.38,21.87 U1.17 | C12.2 11.66,14.21 11.66,10.62 13.56,8.71 16.08,8.71 16.65,9.28 C15.1 16.72,10.9 20.42,10.9 22.34,12.81 C11.2 22.33,14.89 22.33,16.15 21.51,16.97 19.54,16.97 17.55,18.95 17.55,19.76 U1.13 | LED3.C 59.38,49.07 | 59.38,49.07 59.38,51.56 | 59.38,51.56 59.38,54 | LED2.C 59.38,51.56 | LED1.C 59.38,54 | 40.26,60.63 41.58,60.63 42.8,61.85 R1.1 | 40.26,60.63 37.69,60.63 | 37.69,60.63 35.18,60.63 R4.1 | R2.1 40.26,60.63 | 37.69,60.63 37.72,60.66 R3.1 | 51.59,56.16 58.85,56.16 59.38,55.63 59.38,54 | 51.59,56.16 49.15,53.72 49.15,51.82 | R21.2 52.3,34.77 59.38,41.86 59.38,47.04 | 24.08,43.86 R10.1 | U2.84 41.6,53.59 41.81,53.8 42.42,53.8 42.6,53.62 42.6,52.4 | J2.3 J2.5 27.54,69.87 26.59,69.87 25.83,69.11 J2.9 24.84,69.04 24.13,68.33 24.13,65.84 32.26,57.71 | 49.15,51.82 46.79,51.82 45.97,51 42.62,51 | 59.38,47.04 59.38,49.07 | v57.73,47.04 59.38,47.04 | 18.06,48.52 D1.3 | 24.43,14.88 24.46,14.86 | C1.1 39.53,56.98 39.76,57.21 41.73,57.21 41.95,56.98 C2.1 44.21,56.98 44.8,57.58 45.49,57.58 50.16,57.58 51.59,56.16
  Top 0.305: U1.17 17.09,21.97 | 42.62,50.24 v42.42,50.04 | C7.2 29.2,28.94 29.06,29.08 29.06,30.06 | HC-05.13 29.21,26.02 | LED4.C 32.44,7.92 29.4,10.96 HC-05.22
  Top 0.406: 29.21,26.02 C7.2 | HC-05.22 26.19,13.13 24.46,14.86 24.46,25.83 | 24.46,25.83 24.46,30.07 | C8.2 24.46,30.07 | HC-05.13 24.46,25.83 | R10.1 25.6,43.89 25.93,44.22 25.93,50.11 | 35.18,60.63 32.26,57.71 25.93,51.38 25.93,50.11 | 24.08,43.86 24.08,42.7 24.46,42.32 24.46,40.46 | 24.46,30.07 24.46,40.46 | 25.93,50.11 18.39,50.11 18.06,49.78 18.06,48.52 | C11.2 24.43,14.88 | v31.9,34.9 26.34,40.46 24.46,40.46
  Top 0.813: C16.- 16.95,35.4 15.52,36.83 J1.2 | R5.1 12.37,36.75 J1.2 | J1.2 12.27,36.85 8.71,36.85 | D1.3 v18.14,46.35 | C9.2 6.13,21.78 4.78,23.14 4.78,35.87 5.77,36.85 8.71,36.85 | 8.71,36.85 8.66,36.8 C13.2
  Bottom 0.254: C3.2 v38.08,39.75 38.08,40.77 40.44,43.13 43.05,43.13 44.15,44.22 C5.2 44.82,47.16 v45.41,47.75 | v33.38,43.2 33.72,42.86 C4.2 | v42.42,50.04 42.42,49.51 41.99,49.07 C6.2 | R12.2 40.71,34.55 v40.62,34.65 | H1.2 55.19,44.5 v57.73,47.04
  Bottom 0.406: v40.62,34.65 32.16,34.65 v31.9,34.9
  Bottom 0.813: v18.14,46.35 15.19,43.41 15.19,39.73 J1.2
  pour Top: -0.91,71.32 -0.91,-1.4 -1.42,-1.91 64.16,-1.91 64.64,-1.42 64.64,74.8 0.13,74.8 -0.79,73.89 -0.84,73.84 -0.84,70.48
  pour Bottom: -1.04,74.56 -1.04,-1.81 -0.36,-2.49 64.92,-2.49 65.3,-2.11 65.3,75.23 65.28,75.21 -1.04,75.21 -1.04,74.57
HALL
  Top 0.254: U2.65 H1.3 | H1.3 | R11.1 55.59,45.25 55.06,45.78 H1.3
HFX_IN
  Top 0.254: U2.86 40.6,53.81 40.28,54.13 39.79,54.13 C1.2 38.63,55.45 39.69,56.5 OSC1.1
HFX_OUT
  Top 0.254: U2.85 41.1,53.75 42.63,55.28 C2.2 41.37,55.28 OSC1.3
IN1  (via drill 0.35)
  Top 0.254: v13.84,28.68 13.84,28.78 | 22.81,20.8 20.34,18.34 19.1,18.34 18.52,18.92 U1.15
  Top 0.305: U1.3 18.02,26.27 16.41,27.89 F1.2 | v8.03,25.98 8,25.96 C9.1 | F1.2 14.86,29.79 13.84,28.78 | F1.2 21.8,29.79 22.81,28.78 22.81,20.8
  Bottom 0.305: v8.03,25.98 10.72,28.68 v13.84,28.68
IN2/3  (via drill 0.35)
  Top 0.254: 10.26,24.08 v10.24,24.11 | v10.92,26.47 10.95,26.44 15.91,26.44 17.02,25.33 U1.5 | U1.11 C14.2 16.57,14.88 v18.44,14.88 C11.1
  Top 0.305: L1.2 10.26,24.08
  Bottom 0.254: v10.92,26.47 10.62,26.47 10.24,26.09 v10.24,24.11 10.24,18.75 13.72,15.27 18.06,15.27 v18.44,14.88
N$1
  Top 0.254: D1.1 18.16,43.89
  Top 0.305: R9.2 R10.2 18.16,43.89
N$2
  Top 0.254: 11.56,53.99 J3.2_1
  Top 0.813: J3.2_2 J3.2_1 | D1.4 11.56,53.99
N$3
  Top 0.254: R14.1 44.69,7.95 LED4.A
N$4
  Top 0.254: LED3.A 53.35,49.07 R6.1
N$5
  Top 0.254: LED2.A 53.4,51.56 R7.1
N$6
  cutout Top: 26.09,27 26.09,11.94 56.24,11.94 56.24,27.2 26.04,27.2 26.04,26.97
N$7
  cutout Bottom: 26.29,27.03 26.29,11.96 26.42,11.84 55.65,11.84 55.93,12.12 55.93,26.87 55.73,27.08 26.34,27.08
N$8
  Top 0.254: LED1.A 53.38,54 R8.1
N$12  (via drill 0.35)
  Top 0.254: U2.44 v42.6,34.55 v42.6,34.54
  Bottom 0.254: v42.6,34.54 42.6,32.57 R12.1
N$19
  Top 0.254: R14.2 HC-05.31
  Top 0.305: HC-05.31
OUT2  (via drill 0.35)
  Top 0.305: v15.6,17.25 16.02,17.67 U1.10 | v13.66,17.27 13.66,16.72 13.13,16.19 C12.1
  Bottom 0.305: v15.6,17.25 13.71,17.23 v13.66,17.27
PUSH  (via drill 0.35)
  Top 0.254: v42.65,44.65 43.89,45.9 45.64,45.9 46.03,46.28 U2.66
  Top 0.305: R9.1 24.11,46.57 v24.31,46.38
  Bottom 0.254: 42.34,44.65 41.4,45.59 25.09,45.59 v24.31,46.38
  Bottom 0.305: v42.65,44.65 42.34,44.65
RESET  (via drill 0.35)
  Top 0.254: U2.83 42.1,51.06 41.6,50.57 v41.25,50.57 | R21.1 52.3,30.71 v51.36,29.77 51.05,29.46 S1.2 S1.1 48.87,35.05 46.58,37.34 46.58,37.97 41.89,42.67 41.89,46.56 42.55,47.22 v42.55,47.52
  Top 0.305: HC-05.11 32.4,26.89 34.98,29.46 v40.51,29.46
  Bottom 0.254: v40.51,29.46 51.05,29.46 | v42.55,47.52 42.55,48.88 43.1,49.44 43.1,50.45 42.73,50.82 42.03,50.82 41.78,50.57 v41.25,50.57 36.58,50.57 26.64,60.5 26.64,67 25.88,67.77 J2.10
  Bottom 0.305: 51.05,29.46 v51.36,29.77
RLED
  Top 0.254: R7.2 51.58,51.49 50.77,51.49 50.34,51.05 50.34,48.49 49.62,47.78 U2.69
ROW1
  Top 0.254: U2.20 30.96,41.28 29.59,42.65 29.59,51.23 36.7,58.34 50.14,58.34 52.96,61.16 SV1.8
ROW2
  Top 0.254: U2.21 30.59,40.78 28.98,42.39 28.98,51.38 36.47,58.88 48.95,58.88 50.42,60.35 SV1.7
ROW3
  Top 0.254: U2.22 30.36,40.28 28.35,42.29 28.35,51.64 36.2,59.49 46.69,59.49 47.9,60.71 47.9,67.54 SV1.6
ROW4
  Top 0.254: U2.23 30.07,39.78 27.79,42.06 27.79,51.89 35.92,60.02 44.12,60.02 45.34,61.24 SV1.5
RT
  Top 0.254: U1.4 17.52,25.81 15.72,27.61 13.72,27.61 12.37,28.96 R5.2
RX_D
  Top 0.254: U2.35 38.1,35.03 45.95,27.18 45.95,25.88
  Top 0.305: HC-05.2 45.95,25.88
SW  (via drill 0.35)
  Top 0.254: U1.1 v20.24,24.16 20.27,24.18 21.79,24.18 | D2.2 D2.3 21.79,23.29 21.79,24.18 | 21.79,24.18 21.79,27.69 21.64,27.84 C10.2
  Top 0.305: L1.1 12.62,20.14 v13.21,19.56
  Bottom 0.254: 20.24,22.99 v20.24,24.16
  Bottom 0.305: v13.21,19.56 16.82,19.56 20.24,22.99
SWDCLK  (via drill 0.35)
  Top 0.254: U2.95 36.1,53.44 v35.38,54.15
  Bottom 0.254: v35.38,54.15 29.64,59.89 J2.4
SWDIO  (via drill 0.35)
  Top 0.254: U2.94 36.6,54.26 v35.36,55.5
  Bottom 0.254: v35.36,55.5 30.91,59.94 J2.2
SWO  (via drill 0.35)
  Top 0.254: U2.93 37.1,55.03 v36.63,55.5 | v32.16,65.86 29.13,65.86 28.37,66.62 J2.6
  Bottom 0.254: v36.63,55.5 32.16,59.97 v32.16,65.86
TX_D  (via drill 0.35)
  Top 0.254: U2.34 37.6,34.13 v43.74,27.99 | v46.48,27.94 47.4,27.02 HC-05.1
  Bottom 0.254: v43.74,27.99 46.43,27.99
  Bottom 0.305: 46.43,27.99 v46.48,27.94
VCC_1
  Top 0.254: 11.52,60.2 J3.1_1
  Top 0.61: 18.28,40.16 C16.+
  Top 0.813: J3.1_1 J3.1_2 | 11.52,60.2 7.64,60.2 6.68,59.23 6.68,42.67 9.98,39.37 J1.1 15.7,39.37 16.48,40.16 18.28,40.16 | C16.+ 19.82,40.2 20.93,39.09 20.93,33.88 19.64,32.59 F1.1

### Text on the board
tPlace: ECE 477 / Group 2 / Guard DAWG System / PCB v1.1 03/06/2019